# EAGLE design cmdc0de-apa104 (EAGLE 9.1.3)

## Sheet 1 of 2
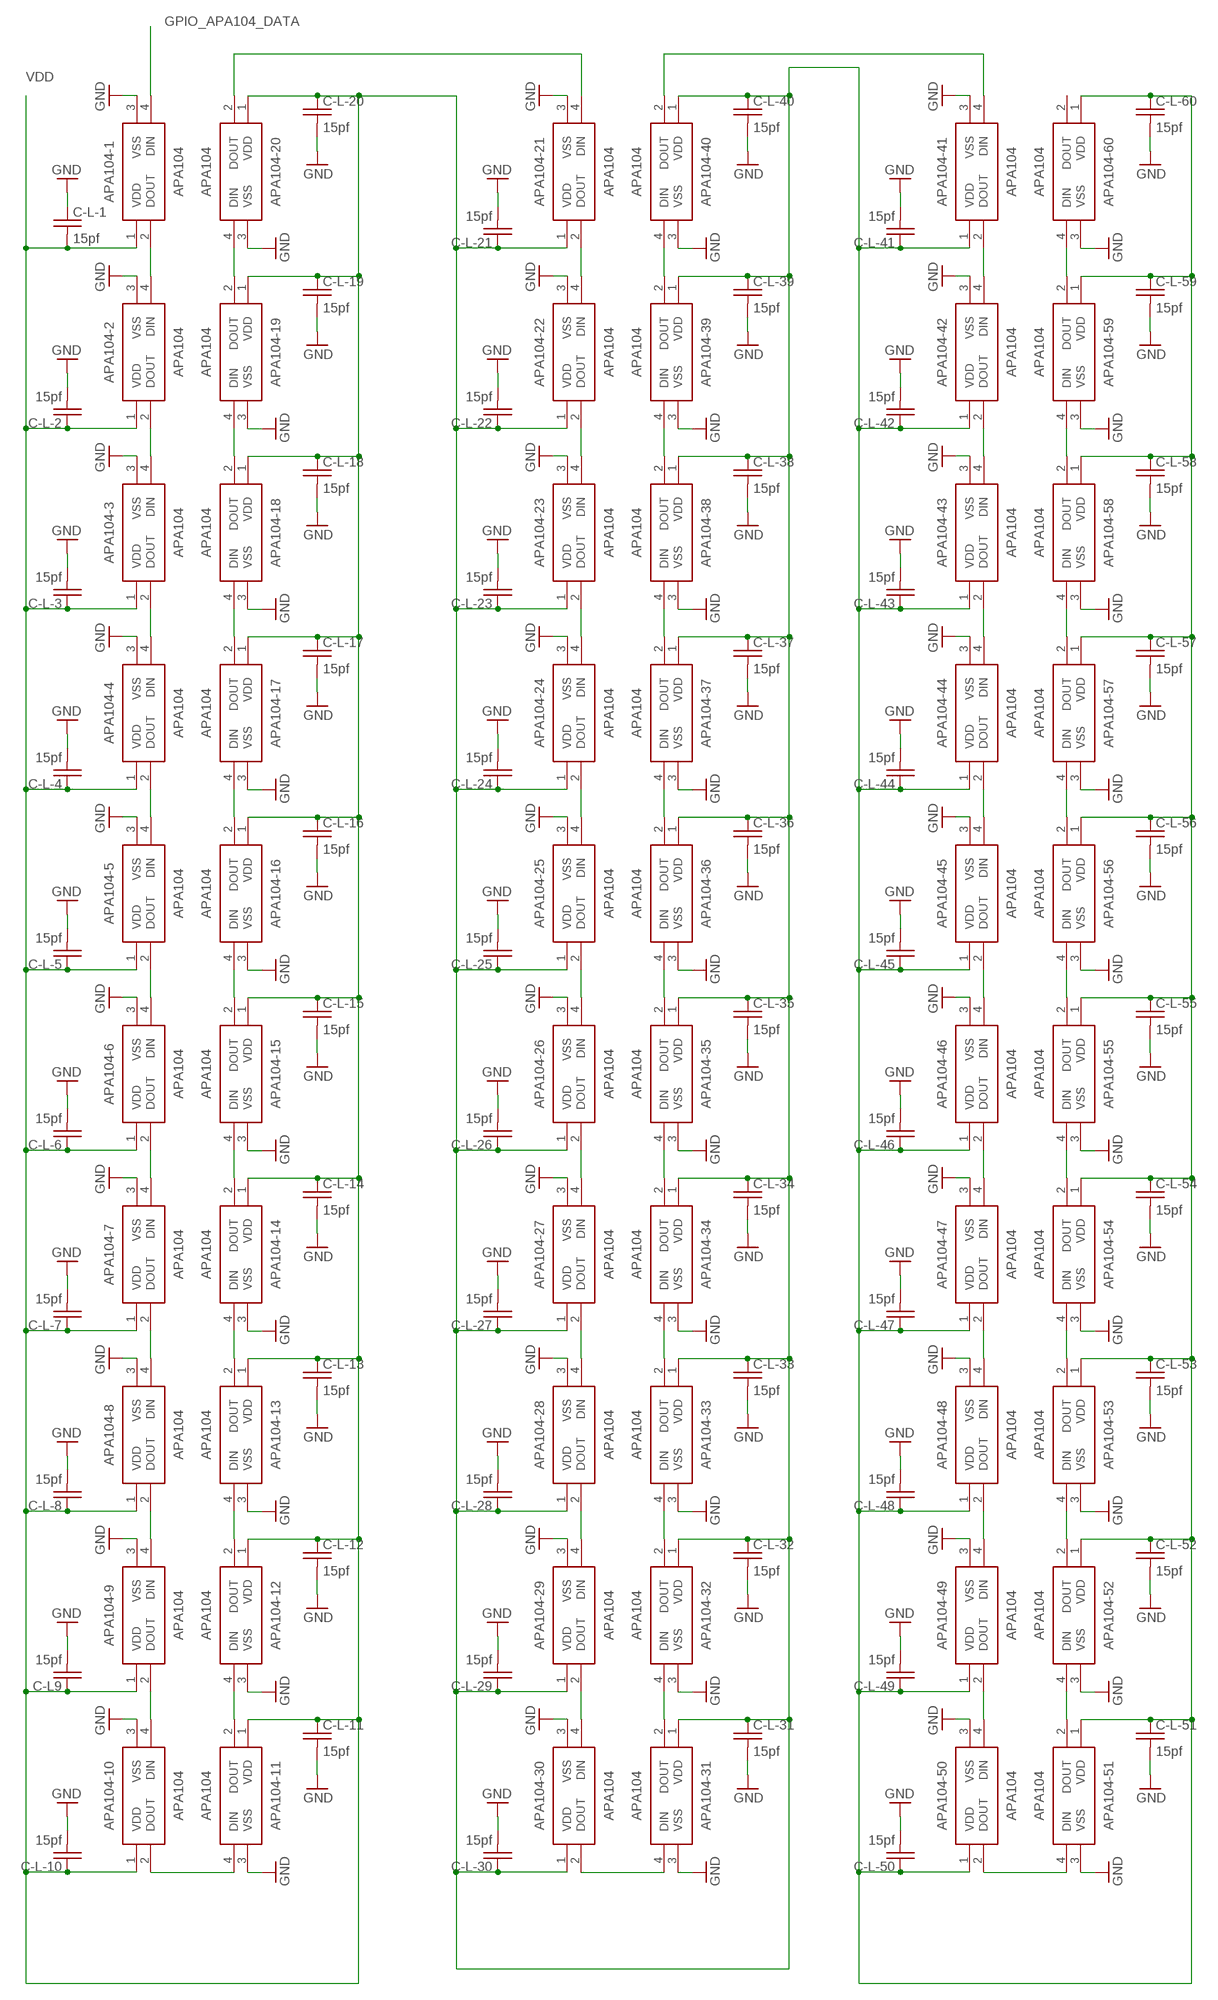
[diagram p0: schematic, sheet 1]

### Parts
APA104-1  APA104  [APA104]
APA104-2  APA104  [APA104]
APA104-3  APA104  [APA104]
APA104-4  APA104  [APA104]
APA104-5  APA104  [APA104]
APA104-6  APA104  [APA104]
APA104-7  APA104  [APA104]
APA104-8  APA104  [APA104]
APA104-9  APA104  [APA104]
APA104-10  APA104  [APA104]
APA104-11  APA104  [APA104]
APA104-12  APA104  [APA104]
APA104-13  APA104  [APA104]
APA104-14  APA104  [APA104]
APA104-15  APA104  [APA104]
APA104-16  APA104  [APA104]
APA104-17  APA104  [APA104]
APA104-18  APA104  [APA104]
APA104-19  APA104  [APA104]
APA104-20  APA104  [APA104]
APA104-21  APA104  [APA104]
APA104-22  APA104  [APA104]
APA104-23  APA104  [APA104]
APA104-24  APA104  [APA104]
APA104-25  APA104  [APA104]
APA104-26  APA104  [APA104]
APA104-27  APA104  [APA104]
APA104-28  APA104  [APA104]
APA104-29  APA104  [APA104]
APA104-30  APA104  [APA104]
APA104-31  APA104  [APA104]
APA104-32  APA104  [APA104]
APA104-33  APA104  [APA104]
APA104-34  APA104  [APA104]
APA104-35  APA104  [APA104]
APA104-36  APA104  [APA104]
APA104-37  APA104  [APA104]
APA104-38  APA104  [APA104]
APA104-39  APA104  [APA104]
APA104-40  APA104  [APA104]
APA104-41  APA104  [APA104]
APA104-42  APA104  [APA104]
APA104-43  APA104  [APA104]
APA104-44  APA104  [APA104]
APA104-45  APA104  [APA104]
APA104-46  APA104  [APA104]
APA104-47  APA104  [APA104]
APA104-48  APA104  [APA104]
APA104-49  APA104  [APA104]
APA104-50  APA104  [APA104]
APA104-51  APA104  [APA104]
APA104-52  APA104  [APA104]
APA104-53  APA104  [APA104]
APA104-54  APA104  [APA104]
APA104-55  APA104  [APA104]
APA104-56  APA104  [APA104]
APA104-57  APA104  [APA104]
APA104-58  APA104  [APA104]
APA104-59  APA104  [APA104]
APA104-60  APA104  [APA104]
C-L9  15pf  C-USC0805-VOLTERA  [C0805-VOLTA]
C-L-1  15pf  C-USC0805-VOLTERA  [C0805-VOLTA]
C-L-2  15pf  C-USC0805-VOLTERA  [C0805-VOLTA]
C-L-3  15pf  C-USC0805-VOLTERA  [C0805-VOLTA]
C-L-4  15pf  C-USC0805-VOLTERA  [C0805-VOLTA]
C-L-5  15pf  C-USC0805-VOLTERA  [C0805-VOLTA]
C-L-6  15pf  C-USC0805-VOLTERA  [C0805-VOLTA]
C-L-7  15pf  C-USC0805-VOLTERA  [C0805-VOLTA]
C-L-8  15pf  C-USC0805-VOLTERA  [C0805-VOLTA]
C-L-10  15pf  C-USC0805-VOLTERA  [C0805-VOLTA]
C-L-11  15pf  C-USC0805-VOLTERA  [C0805-VOLTA]
C-L-12  15pf  C-USC0805-VOLTERA  [C0805-VOLTA]
C-L-13  15pf  C-USC0805-VOLTERA  [C0805-VOLTA]
C-L-14  15pf  C-USC0805-VOLTERA  [C0805-VOLTA]
C-L-15  15pf  C-USC0805-VOLTERA  [C0805-VOLTA]
C-L-16  15pf  C-USC0805-VOLTERA  [C0805-VOLTA]
C-L-17  15pf  C-USC0805-VOLTERA  [C0805-VOLTA]
C-L-18  15pf  C-USC0805-VOLTERA  [C0805-VOLTA]
C-L-19  15pf  C-USC0805-VOLTERA  [C0805-VOLTA]
C-L-20  15pf  C-USC0805-VOLTERA  [C0805-VOLTA]
C-L-21  15pf  C-USC0805-VOLTERA  [C0805-VOLTA]
C-L-22  15pf  C-USC0805-VOLTERA  [C0805-VOLTA]
C-L-23  15pf  C-USC0805-VOLTERA  [C0805-VOLTA]
C-L-24  15pf  C-USC0805-VOLTERA  [C0805-VOLTA]
C-L-25  15pf  C-USC0805-VOLTERA  [C0805-VOLTA]
C-L-26  15pf  C-USC0805-VOLTERA  [C0805-VOLTA]
C-L-27  15pf  C-USC0805-VOLTERA  [C0805-VOLTA]
C-L-28  15pf  C-USC0805-VOLTERA  [C0805-VOLTA]
C-L-29  15pf  C-USC0805-VOLTERA  [C0805-VOLTA]
C-L-30  15pf  C-USC0805-VOLTERA  [C0805-VOLTA]
C-L-31  15pf  C-USC0805-VOLTERA  [C0805-VOLTA]
C-L-32  15pf  C-USC0805-VOLTERA  [C0805-VOLTA]
C-L-33  15pf  C-USC0805-VOLTERA  [C0805-VOLTA]
C-L-34  15pf  C-USC0805-VOLTERA  [C0805-VOLTA]
C-L-35  15pf  C-USC0805-VOLTERA  [C0805-VOLTA]
C-L-36  15pf  C-USC0805-VOLTERA  [C0805-VOLTA]
C-L-37  15pf  C-USC0805-VOLTERA  [C0805-VOLTA]
C-L-38  15pf  C-USC0805-VOLTERA  [C0805-VOLTA]
C-L-39  15pf  C-USC0805-VOLTERA  [C0805-VOLTA]
C-L-40  15pf  C-USC0805-VOLTERA  [C0805-VOLTA]
C-L-41  15pf  C-USC0805-VOLTERA  [C0805-VOLTA]
C-L-42  15pf  C-USC0805-VOLTERA  [C0805-VOLTA]
C-L-43  15pf  C-USC0805-VOLTERA  [C0805-VOLTA]
C-L-44  15pf  C-USC0805-VOLTERA  [C0805-VOLTA]
C-L-45  15pf  C-USC0805-VOLTERA  [C0805-VOLTA]
C-L-46  15pf  C-USC0805-VOLTERA  [C0805-VOLTA]
C-L-47  15pf  C-USC0805-VOLTERA  [C0805-VOLTA]
C-L-48  15pf  C-USC0805-VOLTERA  [C0805-VOLTA]
C-L-49  15pf  C-USC0805-VOLTERA  [C0805-VOLTA]
C-L-50  15pf  C-USC0805-VOLTERA  [C0805-VOLTA]
C-L-51  15pf  C-USC0805-VOLTERA  [C0805-VOLTA]
C-L-52  15pf  C-USC0805-VOLTERA  [C0805-VOLTA]
C-L-53  15pf  C-USC0805-VOLTERA  [C0805-VOLTA]
C-L-54  15pf  C-USC0805-VOLTERA  [C0805-VOLTA]
C-L-55  15pf  C-USC0805-VOLTERA  [C0805-VOLTA]
C-L-56  15pf  C-USC0805-VOLTERA  [C0805-VOLTA]
C-L-57  15pf  C-USC0805-VOLTERA  [C0805-VOLTA]
C-L-58  15pf  C-USC0805-VOLTERA  [C0805-VOLTA]
C-L-59  15pf  C-USC0805-VOLTERA  [C0805-VOLTA]
C-L-60  15pf  C-USC0805-VOLTERA  [C0805-VOLTA]

### Nets
GND: APA104-1.3(VSS) APA104-2.3(VSS) APA104-3.3(VSS) APA104-4.3(VSS) APA104-5.3(VSS) APA104-6.3(VSS) APA104-7.3(VSS) APA104-8.3(VSS) APA104-9.3(VSS) APA104-10.3(VSS) APA104-11.3(VSS) APA104-12.3(VSS) APA104-13.3(VSS) APA104-14.3(VSS) APA104-15.3(VSS) APA104-16.3(VSS) APA104-17.3(VSS) APA104-18.3(VSS) APA104-19.3(VSS) APA104-20.3(VSS) APA104-21.3(VSS) APA104-22.3(VSS) APA104-23.3(VSS) APA104-24.3(VSS) APA104-25.3(VSS) APA104-26.3(VSS) APA104-27.3(VSS) APA104-28.3(VSS) APA104-29.3(VSS) APA104-30.3(VSS) APA104-31.3(VSS) APA104-32.3(VSS) APA104-33.3(VSS) APA104-34.3(VSS) APA104-35.3(VSS) APA104-36.3(VSS) APA104-37.3(VSS) APA104-38.3(VSS) APA104-39.3(VSS) APA104-40.3(VSS) APA104-41.3(VSS) APA104-42.3(VSS) APA104-43.3(VSS) APA104-44.3(VSS) APA104-45.3(VSS) APA104-46.3(VSS) APA104-47.3(VSS) APA104-48.3(VSS) APA104-49.3(VSS) APA104-50.3(VSS) APA104-51.3(VSS) APA104-52.3(VSS) APA104-53.3(VSS) APA104-54.3(VSS) APA104-55.3(VSS) APA104-56.3(VSS) APA104-57.3(VSS) APA104-58.3(VSS) APA104-59.3(VSS) APA104-60.3(VSS) C-L9.2 C-L-1.1 C-L-2.2 C-L-3.2 C-L-4.2 C-L-5.2 C-L-6.2 C-L-7.2 C-L-8.2 C-L-10.2 C-L-11.2 C-L-12.2 C-L-13.2 C-L-14.2 C-L-15.2 C-L-16.2 C-L-17.2 C-L-18.2 C-L-19.2 C-L-20.2 C-L-21.2 C-L-22.2 C-L-23.2 C-L-24.2 C-L-25.2 C-L-26.2 C-L-27.2 C-L-28.2 C-L-29.2 C-L-30.2 C-L-31.2 C-L-32.2 C-L-33.2 C-L-34.2 C-L-35.2 C-L-36.2 C-L-37.2 C-L-38.2 C-L-39.2 C-L-40.2 C-L-41.2 C-L-42.2 C-L-43.2 C-L-44.2 C-L-45.2 C-L-46.2 C-L-47.2 C-L-48.2 C-L-49.2 C-L-50.2 C-L-51.2 C-L-52.2 C-L-53.2 C-L-54.2 C-L-55.2 C-L-56.2 C-L-57.2 C-L-58.2 C-L-59.2 C-L-60.2 ; also sheet 2
GPIO_APA104_DATA: APA104-1.4(DIN) ; also sheet 2
GPIO_APA104_DATA1: APA104-40.2(DOUT) APA104-41.4(DIN)
N$1: APA104-2.2(DOUT) APA104-3.4(DIN)
N$2: APA104-3.2(DOUT) APA104-4.4(DIN)
N$3: APA104-4.2(DOUT) APA104-5.4(DIN)
N$4: APA104-5.2(DOUT) APA104-6.4(DIN)
N$5: APA104-6.2(DOUT) APA104-7.4(DIN)
N$6: APA104-7.2(DOUT) APA104-8.4(DIN)
N$7: APA104-8.2(DOUT) APA104-9.4(DIN)
N$8: APA104-9.2(DOUT) APA104-10.4(DIN)
N$9: APA104-10.2(DOUT) APA104-11.4(DIN)
N$10: APA104-11.2(DOUT) APA104-12.4(DIN)
N$11: APA104-12.2(DOUT) APA104-13.4(DIN)
N$12: APA104-13.2(DOUT) APA104-14.4(DIN)
N$13: APA104-14.2(DOUT) APA104-15.4(DIN)
N$14: APA104-15.2(DOUT) APA104-16.4(DIN)
N$15: APA104-16.2(DOUT) APA104-17.4(DIN)
N$16: APA104-17.2(DOUT) APA104-18.4(DIN)
N$17: APA104-18.2(DOUT) APA104-19.4(DIN)
N$18: APA104-19.2(DOUT) APA104-20.4(DIN)
N$19: APA104-21.2(DOUT) APA104-22.4(DIN)
N$20: APA104-22.2(DOUT) APA104-23.4(DIN)
N$21: APA104-23.2(DOUT) APA104-24.4(DIN)
N$22: APA104-24.2(DOUT) APA104-25.4(DIN)
N$23: APA104-25.2(DOUT) APA104-26.4(DIN)
N$24: APA104-26.2(DOUT) APA104-27.4(DIN)
N$25: APA104-27.2(DOUT) APA104-28.4(DIN)
N$26: APA104-28.2(DOUT) APA104-29.4(DIN)
N$27: APA104-29.2(DOUT) APA104-30.4(DIN)
N$28: APA104-30.2(DOUT) APA104-31.4(DIN)
N$29: APA104-20.2(DOUT) APA104-21.4(DIN)
N$30: APA104-41.2(DOUT) APA104-42.4(DIN)
N$31: APA104-1.2(DOUT) APA104-2.4(DIN)
N$32: APA104-31.2(DOUT) APA104-32.4(DIN)
N$33: APA104-32.2(DOUT) APA104-33.4(DIN)
N$34: APA104-33.2(DOUT) APA104-34.4(DIN)
N$35: APA104-34.2(DOUT) APA104-35.4(DIN)
N$36: APA104-35.2(DOUT) APA104-36.4(DIN)
N$37: APA104-36.2(DOUT) APA104-37.4(DIN)
N$38: APA104-37.2(DOUT) APA104-38.4(DIN)
N$39: APA104-38.2(DOUT) APA104-39.4(DIN)
N$40: APA104-39.2(DOUT) APA104-40.4(DIN)
N$41: APA104-50.2(DOUT) APA104-51.4(DIN)
N$42: APA104-42.2(DOUT) APA104-43.4(DIN)
N$43: APA104-43.2(DOUT) APA104-44.4(DIN)
N$44: APA104-44.2(DOUT) APA104-45.4(DIN)
N$45: APA104-45.2(DOUT) APA104-46.4(DIN)
N$46: APA104-46.2(DOUT) APA104-47.4(DIN)
N$47: APA104-47.2(DOUT) APA104-48.4(DIN)
N$48: APA104-48.2(DOUT) APA104-49.4(DIN)
N$49: APA104-49.2(DOUT) APA104-50.4(DIN)
N$51: APA104-51.2(DOUT) APA104-52.4(DIN)
N$52: APA104-52.2(DOUT) APA104-53.4(DIN)
N$53: APA104-53.2(DOUT) APA104-54.4(DIN)
N$54: APA104-54.2(DOUT) APA104-55.4(DIN)
N$55: APA104-55.2(DOUT) APA104-56.4(DIN)
N$56: APA104-56.2(DOUT) APA104-57.4(DIN)
N$57: APA104-57.2(DOUT) APA104-58.4(DIN)
N$58: APA104-58.2(DOUT) APA104-59.4(DIN)
N$59: APA104-59.2(DOUT) APA104-60.4(DIN)
VDD: APA104-1.1(VDD) APA104-2.1(VDD) APA104-3.1(VDD) APA104-4.1(VDD) APA104-5.1(VDD) APA104-6.1(VDD) APA104-7.1(VDD) APA104-8.1(VDD) APA104-9.1(VDD) APA104-10.1(VDD) APA104-11.1(VDD) APA104-12.1(VDD) APA104-13.1(VDD) APA104-14.1(VDD) APA104-15.1(VDD) APA104-16.1(VDD) APA104-17.1(VDD) APA104-18.1(VDD) APA104-19.1(VDD) APA104-20.1(VDD) APA104-21.1(VDD) APA104-22.1(VDD) APA104-23.1(VDD) APA104-24.1(VDD) APA104-25.1(VDD) APA104-26.1(VDD) APA104-27.1(VDD) APA104-28.1(VDD) APA104-29.1(VDD) APA104-30.1(VDD) APA104-31.1(VDD) APA104-32.1(VDD) APA104-33.1(VDD) APA104-34.1(VDD) APA104-35.1(VDD) APA104-36.1(VDD) APA104-37.1(VDD) APA104-38.1(VDD) APA104-39.1(VDD) APA104-40.1(VDD) APA104-41.1(VDD) APA104-42.1(VDD) APA104-43.1(VDD) APA104-44.1(VDD) APA104-45.1(VDD) APA104-46.1(VDD) APA104-47.1(VDD) APA104-48.1(VDD) APA104-49.1(VDD) APA104-50.1(VDD) APA104-51.1(VDD) APA104-52.1(VDD) APA104-53.1(VDD) APA104-54.1(VDD) APA104-55.1(VDD) APA104-56.1(VDD) APA104-57.1(VDD) APA104-58.1(VDD) APA104-59.1(VDD) APA104-60.1(VDD) C-L9.1 C-L-1.2 C-L-2.1 C-L-3.1 C-L-4.1 C-L-5.1 C-L-6.1 C-L-7.1 C-L-8.1 C-L-10.1 C-L-11.1 C-L-12.1 C-L-13.1 C-L-14.1 C-L-15.1 C-L-16.1 C-L-17.1 C-L-18.1 C-L-19.1 C-L-20.1 C-L-21.1 C-L-22.1 C-L-23.1 C-L-24.1 C-L-25.1 C-L-26.1 C-L-27.1 C-L-28.1 C-L-29.1 C-L-30.1 C-L-31.1 C-L-32.1 C-L-33.1 C-L-34.1 C-L-35.1 C-L-36.1 C-L-37.1 C-L-38.1 C-L-39.1 C-L-40.1 C-L-41.1 C-L-42.1 C-L-43.1 C-L-44.1 C-L-45.1 C-L-46.1 C-L-47.1 C-L-48.1 C-L-49.1 C-L-50.1 C-L-51.1 C-L-52.1 C-L-53.1 C-L-54.1 C-L-55.1 C-L-56.1 C-L-57.1 C-L-58.1 C-L-59.1 C-L-60.1 ; also sheet 2
Unconnected: APA104-60.2(DOUT)

## Sheet 2 of 2
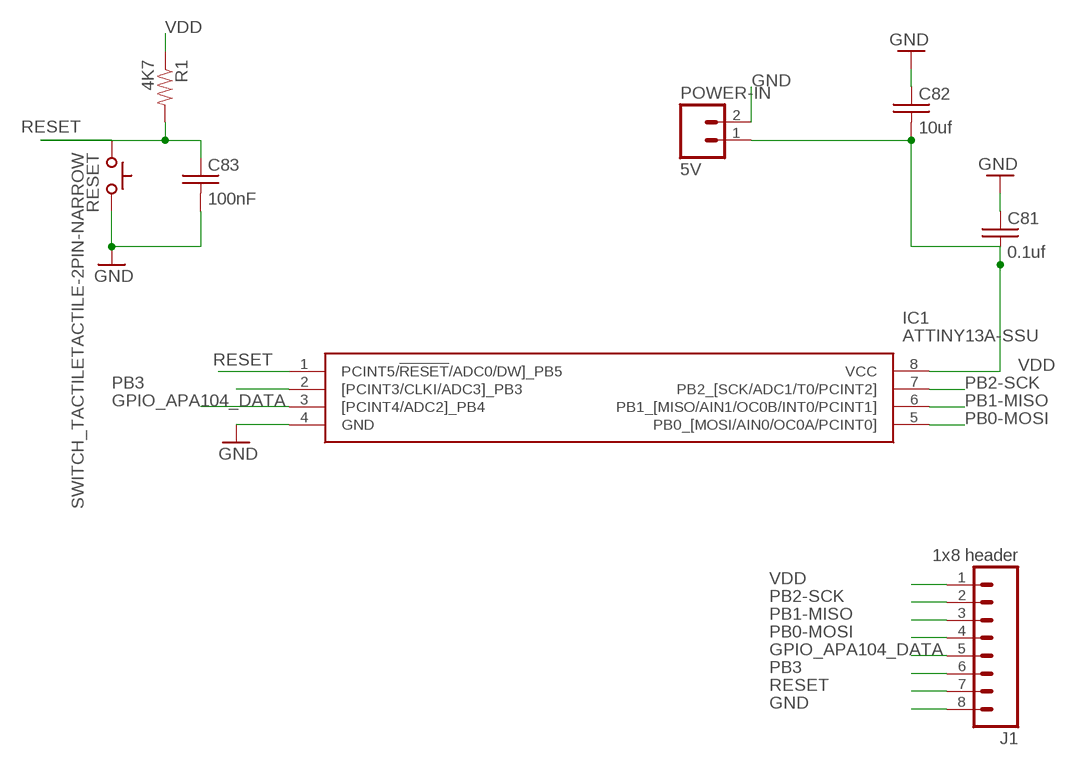
[diagram p1: schematic, sheet 2]

### Parts
C81  0.1uf  C-USC0805-VOLTERA  [C0805-VOLTA]
C82  10uf  C-USC0805-VOLTERA  [C0805-VOLTA]
C83  100nF  C-USC0805-VOLTERA  [C0805-VOLTA]
IC1  ATTINY13A-SSU  [SOIC127P600X175-8N]
J1  1x8 header  M08SILK_FEMALE_PTH  [1X08]
POWER-IN  5V  M02PTH  [1X02]
R1  4K7  RESISTOR0805-RES  [0805]
RESET  SWITCH_TACTILETACTILE-2PIN-NARROW  [TACTILE-2PIN-NARROW]

### Nets
GND: C81.1 C82.1 C83.2 IC1.4(GND) J1.8 POWER-IN.2 RESET.P$1(A) ; also sheet 1
GPIO_APA104_DATA: IC1.3([PCINT4/ADC2]_PB4) J1.5 ; also sheet 1
PB0-MOSI: IC1.5(PB0_[MOSI/AIN0/OC0A/PCINT0]) J1.4
PB1-MISO: IC1.6(PB1_[MISO/AIN1/OC0B/INT0/PCINT1]) J1.3
PB2-SCK: IC1.7(PB2_[SCK/ADC1/T0/PCINT2]) J1.2
PB3: IC1.2([PCINT3/CLKI/ADC3]_PB3) J1.6
RESET: C83.1 IC1.1(PCINT5/!RESET!/ADC0/DW]_PB5) J1.7 R1.2 RESET.P$2(C)
VDD: C81.2 C82.2 IC1.8(VCC) J1.1 POWER-IN.1 R1.1 ; also sheet 1

## Library data of the parts
APA104-1-APA104-60 = name-in-lights:APA104: APA104 LED CHIP Source: Datasheet <http://www.ledlightinghut.com/files/APA104%20Datasheet.pdf>; DESCRIPTION: APA104 LED Chip; HEIGHT: mm; MANUFACTURER_NAME: Worldsemi; MANUFACTURER_PART_NUMBER: APA104; SUPPLIER_NAME: RS
C81-C83 C-L9 C-L-1-C-L-8 C-L-10-C-L-60 = name-in-lights:C-US: CAPACITOR, American symbol
IC1 = NameInLights:ATTINY13A-SSU: ATTINY13A-SSU, 8 bit AVR Microcontroller 20MHz 1, 64kB, B Flash, 64B RAM, SPI 8-Pin SOIC Source: Datasheet <http://www.atmel.com/images/doc8126.pdf>; ARROW_PART_NUMBER: ATTINY13A-SSU; ARROW_PRICE/STOCK: https://www.arrow.com/en/products/attiny13a-ssu/microchip-technology; DESCRIPTION: ATTINY13A-SSU, 8 bit AVR Microcontroller 20MHz 1, 64kB, B Flash, 64B RAM, SPI 8-Pin SOIC; HEIGHT: 1.75mm; MANUFACTURER_NAME: Microchip; MANUFACTURER_PART_NUMBER: ATTINY13A-SSU; RS_PART_NUMBER: 9214573; RS_PRICE/STOCK: http://uk.rs-online.com/web/p/products/9214573
J1 = NameInLights:M08: Header 8 Standard 8-pin 0.1" header. Use with straight break away headers (SKU : PRT-00116), right angle break away headers (PRT-00553), swiss pins (PRT-00743), machine pins (PRT-00117), and female headers (PRT-00115).; PROD_ID: CONN-08438
POWER-IN = name-in-lights:M02: Standard 2-pin 0.1" header. Use with - straight break away headers ( PRT-00116) - right angle break away headers (PRT-00553) - swiss pins (PRT-00743) - machine pins (PRT-00117) - female headers (PRT-00115) Molex polarized connector foot print use with: PRT-08233 with associated crimp pins and housings. 2.54_SCREWTERM for use with PRT-10571. 3.5mm Screw Terminal footprints for PRT-08084 5mm Screw Terminal footprints for use with PRT-08432
R1 = NameInLights:RESISTOR: Resistor Basic schematic elements and footprints for 0603, 1206, and PTH resistors.
RESET = NameInLights:SWITCH_TACTILE

## Board
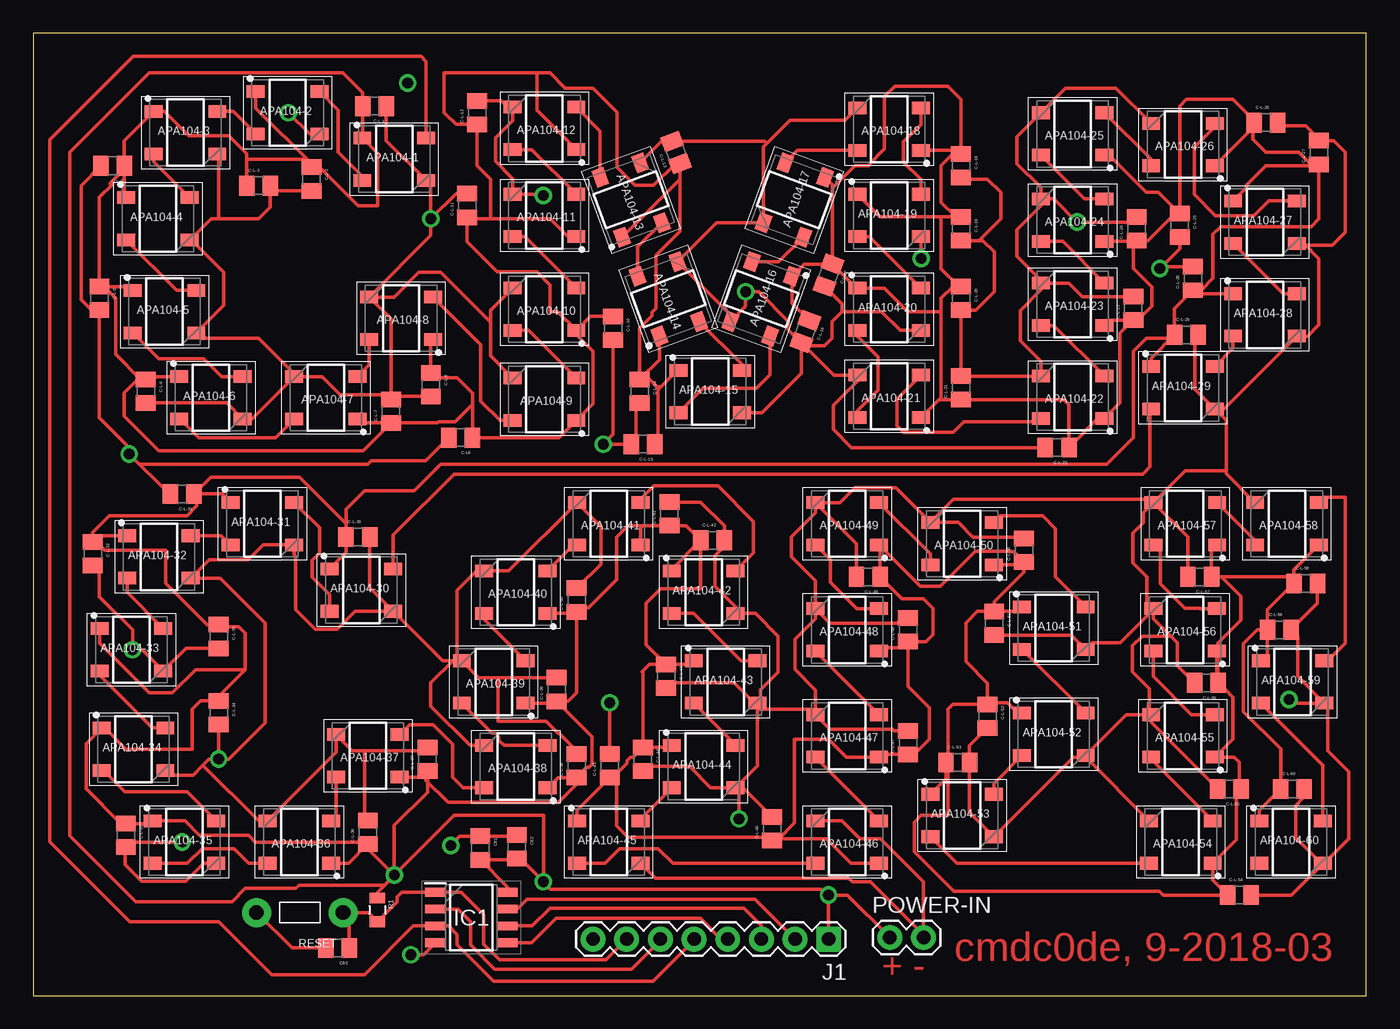
[diagram p2: board, top side]
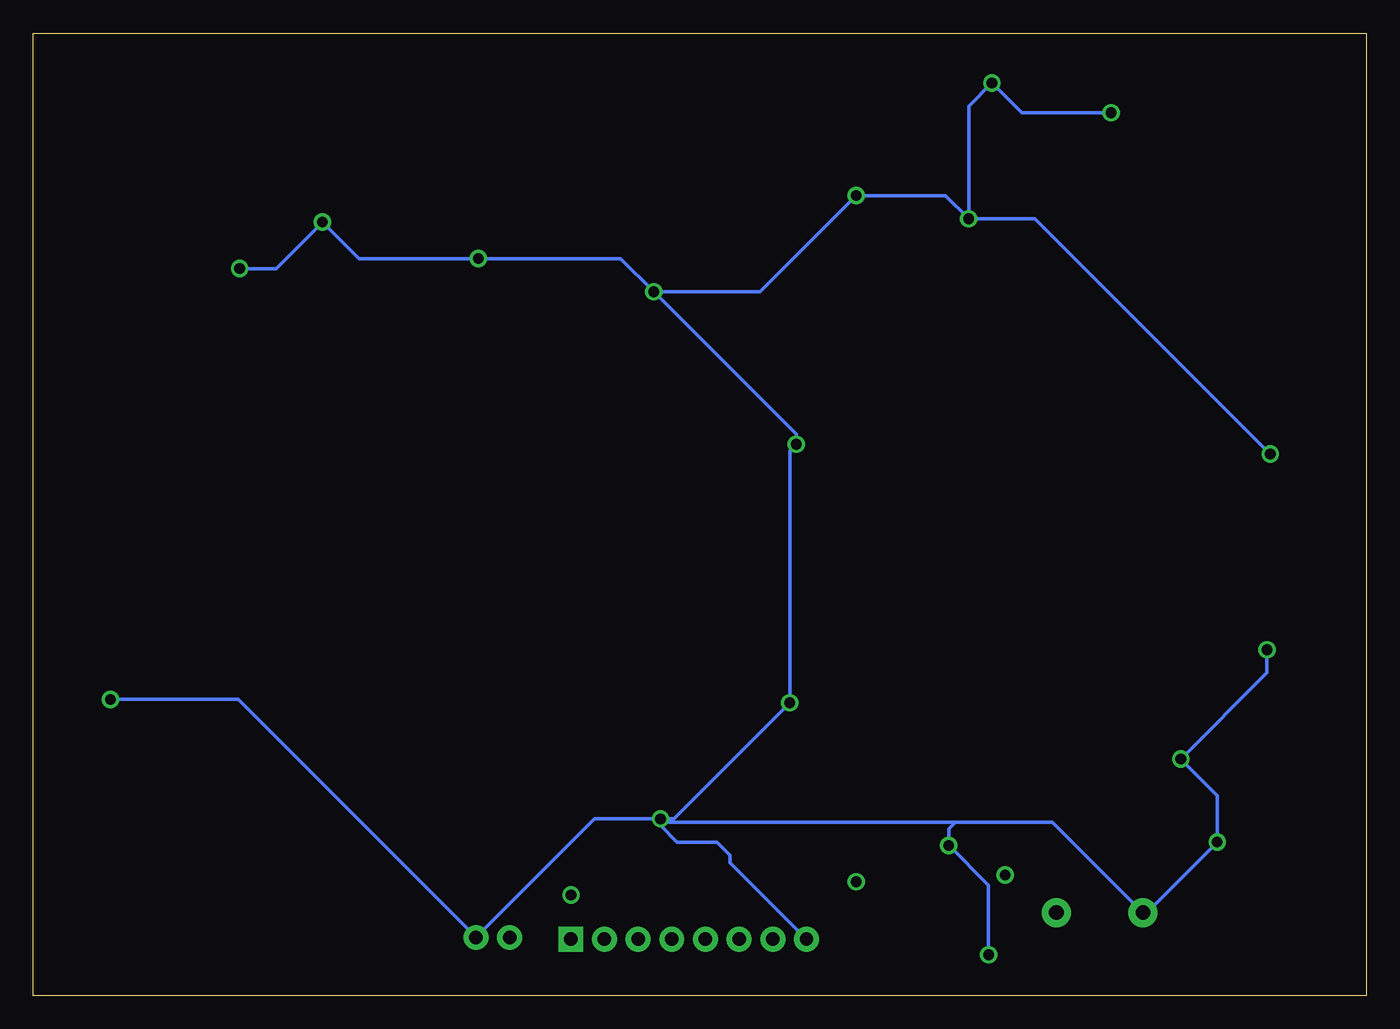
[diagram p3: board, bottom side, seen from below]

Size 100.58 x 72.6 mm. Coordinates in mm from the lower left corner, seen from the top.
Outline: 0,0 100.58,0 100.58,72.6 0,72.6 0,0
Copper layers (1*16): Top 0.035mm / dielectric 1.5mm / Bottom 0.035mm
Design rules "OthermillDRC_1_100_v2": minimum track width 8mil, minimum drill 0.8mm, track to track 0.256540625mm, track to pad 0.256540625mm, pad to pad 0.256540625mm, via to via 0.256540625mm, smd to smd 0mil, copper to edge 0mil, drill to drill 1mil, minimum pad ring 10mil, minimum via ring 10mil, stop-mask expansion 1mil, vias tented up to drill 30mil, thermal gap 10mil

### Footprints (pad centres in the part's own frame; a part is rotated, then mirrored left to right if it is on the bottom)
APA104 = smd 1.35 x 0.95: 1 -2.4,1.6; 2 -2.4,-1.6; 3 2.4,-1.6; 4 2.4,1.6
C0805-VOLTA = smd 1.168 x 1.499: 1 -0.889,0; 2 0.889,0
SOIC127P600X175-8N = smd 1.525 x 0.65: 1 -2.712,1.905; 2 -2.712,0.635; 3 -2.712,-0.635; 4 -2.712,-1.905; 5 2.712,-1.905; 6 2.712,-0.635; 7 2.712,0.635; 8 2.712,1.905
1X08 = drill 1.016 pad 1.88 square: 1 0,0 | drill 1.016 pad 1.88: 2 2.54,0; 3 5.08,0; 4 7.62,0; 5 10.16,0; 6 12.7,0; 7 15.24,0; 8 17.78,0
1X02 = drill 1.016 pad 1.88: 1 0,0; 2 2.54,0
0805 = smd 0.8 x 1.2: 1 -0.9,0; 2 0.9,0
TACTILE-2PIN-NARROW = drill 1.1 pad 2.184: P$1 3.264,0; P$2 -3.264,0

### Placement (x,y rotation side)
APA104-1  27.24,63.1 0 top
APA104-2  19.2,66.6 0 top
APA104-3  11.5,65.1 0 top
APA104-4  9.42,58.6 0 top
APA104-5  9.92,51.6 0 top
APA104-6  13.42,45.1 0 top
APA104-7  22.08,45.1 180 top
APA104-8  27.76,51.1 180 top
APA104-9  38.58,44.99 180 top
APA104-10  38.58,51.78 180 top
APA104-11  38.58,58.85 180 top
APA104-12  38.58,65.42 180 top
APA104-13  45.11,60.02 110 top
APA104-14  47.92,52.56 110 top
APA104-15  51.08,45.57 0 top
APA104-16  54.92,52.56 250 top
APA104-17  57.42,60.02 250 top
APA104-18  64.58,65.36 180 top
APA104-19  64.58,58.85 0 top
APA104-20  64.58,51.78 0 top
APA104-21  64.58,45.21 180 top
APA104-22  78.42,45.15 180 top
APA104-23  78.42,52.15 180 top
APA104-24  78.42,58.5 180 top
APA104-25  78.42,65 180 top
APA104-26  86.74,64.2 180 top
APA104-27  92.92,58.35 0 top
APA104-28  92.92,51.35 0 top
APA104-29  86.74,45.85 0 top
APA104-30  24.76,30.6 0 top
APA104-31  17.3,35.6 0 top
APA104-32  9.5,33.1 0 top
APA104-33  7.42,26.1 0 top
APA104-34  7.58,18.6 0 top
APA104-35  11.42,11.6 0 top
APA104-36  20.08,11.6 180 top
APA104-37  25.26,18.1 180 top
APA104-38  36.42,17.29 180 top
APA104-39  34.74,23.67 180 top
APA104-40  36.42,30.44 180 top
APA104-41  43.42,35.6 180 top
APA104-42  50.58,30.44 0 top
APA104-43  52.24,23.67 0 top
APA104-44  50.58,17.29 0 top
APA104-45  43.42,11.6 0 top
APA104-46  61.42,11.6 180 top
APA104-47  61.42,19.6 180 top
APA104-48  61.42,27.6 180 top
APA104-49  61.42,35.6 180 top
APA104-50  70.08,34.1 180 top
APA104-51  77,27.73 0 top
APA104-52  77,19.73 0 top
APA104-53  70.08,13.6 0 top
APA104-54  86.58,11.6 180 top
APA104-55  86.74,19.6 180 top
APA104-56  86.9,27.6 180 top
APA104-57  86.92,35.6 180 top
APA104-58  94.58,35.6 180 top
APA104-59  95.01,23.67 0 top
APA104-60  94.9,11.6 0 top
C81  33.74,11.15 270 top
C82  36.49,11.23 270 top
C83  22.96,3.61 180 top
C-L9  32.25,42.1 180 top
C-L-1  25.75,67.1 180 top
C-L-2  21,61.6 270 top
C-L-3  17,61.1 0 top
C-L-4  6,62.6 180 top
C-L-5  5,52.6 270 top
C-L-6  8.5,45.6 270 top
C-L-7  27,44.1 90 top
C-L-8  30,46.1 270 top
C-L-10  43.75,50.35 270 top
C-L-11  32.75,59.6 90 top
C-L-12  33.5,66.6 90 top
C-L-13  48.5,63.6 110 top
C-L-14  45.75,45.6 270 top
C-L-15  46,41.6 180 top
C-L-16  58.25,50.1 250 top
C-L-17  60,54.35 250 top
C-L-18  70,62.6 270 top
C-L-19  70,57.85 270 top
C-L-20  70,52.6 270 top
C-L-21  70,45.85 90 top
C-L-22  77.25,41.35 180 top
C-L-23  83,51.85 90 top
C-L-24  83.25,57.85 90 top
C-L-25  86.5,58.1 270 top
C-L-26  93,65.85 0 top
C-L-27  97,63.6 90 top
C-L-28  87.5,54.1 90 top
C-L-29  87,49.85 0 top
C-L-30  24.5,34.6 0 top
C-L-31  11.25,37.85 180 top
C-L-32  4.5,33.35 270 top
C-L-33  14,27.1 270 top
C-L-34  14,21.35 270 top
C-L-35  7,12.1 270 top
C-L-36  25.25,12.35 90 top
C-L-37  29.75,17.85 90 top
C-L-38  41,17.35 90 top
C-L-39  39.5,23.1 90 top
C-L-40  41,29.85 90 top
C-L-41  48,36.35 90 top
C-L-42  51.25,34.35 0 top
C-L-43  47.75,24.1 270 top
C-L-44  46,17.85 270 top
C-L-45  43.5,17.35 90 top
C-L-46  55.75,12.6 90 top
C-L-47  66,19.1 90 top
C-L-48  66,27.6 90 top
C-L-49  63,31.6 180 top
C-L-50  74.75,33.6 90 top
C-L-51  72.5,28.1 270 top
C-L-52  72,21.1 270 top
C-L-53  69.75,17.6 0 top
C-L-54  91,7.6 0 top
C-L-55  90.25,15.6 180 top
C-L-56  88.5,23.6 180 top
C-L-57  88,31.6 180 top
C-L-58  96,31.1 0 top
C-L-59  94,27.6 0 top
C-L-60  95,15.6 0 top
IC1  33.06,5.91 0 top
J1  60.02,4.28 180 top
POWER-IN  64.63,4.4 0 top
R1  25.97,6.49 270 top
RESET  20.12,6.28 180 top

### Tracks (layer width: path | path; a pad name or v marks a point on that pad's centre or on a via)
GND  (via drill 0.8)
  Top 0.254: C-L-1.1 26.64,64.5 APA104-1.3 30,61.14 v30,58.6 | C-L-6.2 14.61,44.71 APA104-6.3 16.48,43.5 APA104-7.3 | C-L-5.2 5,51.12 | C-L-7.2 27,51.06 APA104-8.3 | C-L-8.2 27.22,45.21 C-L-7.2 | APA104-9.3 34.51,48.26 34.51,50.79 | APA104-8.3 27.22,52.7 29.08,54.56 30.74,54.56 34.51,50.79 | 34.51,50.79 34.51,51.71 APA104-10.3 | 36.18,66.6 36.18,66.01 34.87,64.7 34.87,62.94 36.18,61.63 APA104-11.3 38.4,60.45 v38.5,60.35 | 36.18,66.6 APA104-12.3 | C-L-12.2 35.29,67.49 36.18,66.6 | APA104-18.3 61.24,66.02 57.09,66.02 55.34,64.27 | 55.34,64.27 55.1,64.03 APA104-17.3 51.55,58.31 APA104-14.3 52.6,51.37 APA104-16.3 53.75,52.01 v53.75,53.1 54.75,53.1 57,50.85 57,50.21 C-L-16.2 | C-L-16.2 57.95,46.94 54.98,43.97 APA104-15.3 | C-L-16.2 58.18,49.03 | 58.18,49.03 60.4,46.81 APA104-21.3 62.18,46.34 60.37,44.53 60.37,42.73 61.75,41.35 C-L-22.2 | APA104-23.3 76.02,53.24 74.46,51.68 74.46,49.42 76.02,47.86 APA104-22.3 76.01,46.74 C-L-21.2 C-L-20.2 71.11,51.71 72.5,53.1 72.5,56.1 71.64,56.96 C-L-19.2 71.36,56.96 73,58.6 73,60.6 72,61.6 70.11,61.6 C-L-18.2 | APA104-23.3 78.13,53.75 79.14,52.74 C-L-23.2 | APA104-23.3 76.02,53.96 74.21,55.77 74.21,57.78 76.02,59.59 APA104-24.3 | APA104-24.3 76.02,60.96 74.21,62.77 74.21,64.78 APA104-25.3 77.88,68.46 81.68,68.46 APA104-26.3 | APA104-29.3 89.82,44.25 APA104-28.3 96.15,49.75 97,50.6 97,55.6 95.85,56.75 APA104-27.3 95.47,56.6 98,56.6 99,57.6 99,63.6 98.11,64.49 C-L-27.2 97,64.6 96,65.6 94.14,65.6 C-L-26.2 | APA104-29.3 87.64,45.75 87.64,49.6 C-L-29.2 | APA104-29.3 90,43.39 90,39.6 | APA104-58.3 90,39.38 90,39.6 | 90,39.6 86.92,39.6 APA104-57.3
  Top 0.254: C-L-58.2 96.89,29.6 C-L-59.2 95.39,27.1 95.39,24.09 APA104-59.3 | APA104-60.3 97.2,9.9 | 97.2,9.9 94.9,7.6 C-L-54.2 | APA104-54.3 79.4,17.98 | 79.4,17.98 APA104-52.3 82.47,21.2 APA104-55.3 | 85.83,27.11 83.67,27.11 82.94,26.38 82.94,24.43 84.21,23.16 84.21,21.33 APA104-55.3 | 85.83,27.11 86.31,26.63 86.31,24.91 C-L-56.2 | 84.5,29.1 APA104-56.3 84.02,29.68 84.02,31.6 82.96,32.66 82.96,34.88 83.77,35.69 83.77,36.45 APA104-57.3 | 85.83,27.11 84.5,28.44 84.5,29.1 | 84.5,29.1 82.03,26.63 79.9,26.63 APA104-51.3 78.32,27.21 C-L-51.2 | C-L-57.2 87.11,34.61 APA104-57.3 | APA104-50.3 69.43,37.45 84.27,37.45 APA104-57.3 | APA104-50.3 69.79,35.7 70.9,34.59 74.64,34.59 C-L-50.2 | APA104-49.3 60.88,37.2 61.99,38.31 65.07,38.31 APA104-50.3 | APA104-49.3 62.11,34.11 C-L-49.2 | APA104-49.3 59.02,36.44 57.21,34.63 57.21,33.12 59.02,31.31 APA104-48.3 | C-L-48.2 65.55,28.49 65.15,28.09 60.13,28.09 APA104-48.3 | APA104-48.3 59.02,28.44 57.46,26.88 57.46,24.62 59.02,23.06 APA104-47.3 | C-L-47.2 64.94,19.99 64.82,20.11 60.11,20.11 APA104-47.3 | 79.4,17.98 78.46,17.98 APA104-53.3 70.64,13.84 C-L-53.2 70.64,18.85 C-L-52.2 | 67.17,4.6 67.17,8.59 63.9,11.86 62.36,11.86 61.02,13.2 APA104-46.3 | 67.17,4.6 POWER-IN.2 | C-L-46.2 53.55,15.69 53,15.69 | 53,15.69 APA104-44.3 | APA104-44.3 51.12,15.69 49.51,17.3 46.34,17.3 C-L-44.2 | APA104-44.3 54.64,17.35 54.64,21.6 | 54.64,21.6 54.64,21.85 | 54.64,21.85 APA104-43.3 54.89,22.32 54.89,23.08 56.2,24.39 56.2,27.12 54.48,28.84 APA104-42.3 52.98,29.35 51.42,30.91 51.42,33.17 52.14,33.89 C-L-42.2 52.14,35.46 50.36,37.24 C-L-41.2 | APA104-47.3 58.62,21.6 54.64,21.6
  Top 0.254: C-L-40.2 42.83,32.57 42.83,35.38 41.02,37.19 APA104-41.3 35.86,32.04 APA104-40.3 33.44,32.04 32,30.6 32,25.61 APA104-39.3 | C-L-30.2 25.39,30.77 APA104-30.3 | 31.67,25.27 30.89,25.27 APA104-30.3 | APA104-30.3 24.3,29 22.94,27.64 21.28,27.64 19.8,29.12 19.8,33.15 19.7,33.25 APA104-31.3 17.34,34 16.23,32.89 13.29,32.89 APA104-32.3 14.1,31.5 17.5,28.1 17.5,20.6 14.75,17.85 v14,17.85 | APA104-34.3 10.33,16.65 12.06,16.65 12.81,17.4 | 12.81,17.4 17.01,13.2 APA104-36.3 22.86,18.38 APA104-37.3 24.07,18.49 25,18.49 | 25,18.49 29.5,18.49 C-L-37.2 | C-L-39.2 35,23.99 | 35,23.99 33.62,23.99 APA104-39.3 | APA104-45.3 46.94,8.88 61.52,8.88 61.8,8.6 63.17,8.6 67.17,4.6 | APA104-24.3 77,60.1 v78.75,58.35 82.86,58.35 C-L-24.2 | v53.25,13.35 53.25,15.44 53,15.69 | APA104-35.3 12.85,10 11.49,8.64 8.19,8.64 6.96,9.87 6.96,11 7,11.03 C-L-35.2 7.39,11.6 v11.25,11.6 | 12.81,17.4 13.26,17.85 v14,17.85 | C-L-45.2 v43.5,22.1 | APA104-8.3 30,57.34 v30,58.6 | APA104-7.3 21.79,46.7 23.15,45.34 26.64,45.34 C-L-7.2 | APA104-19.3 66.98,55.62 v67,55.6 | 5,51.12 3.62,52.5 3.62,61.11 C-L-4.2 | v31.5,11.35 32.19,12.04 C81.1 36.41,12.04 C82.1 | v7.25,40.85 7.25,41.35 5,43.6 5,51.12 | v7.25,40.85 10.25,37.85 C-L-31.2 | APA104-59.3 97.66,21.82 97.66,18.49 99.25,16.9 99.25,11.85 97.3,9.9 | C83.2 19.53,3.61 RESET.P$1 | C-L-34.2 v14,17.85 | 14,58.6 13.42,58.6 APA104-4.3 11.96,57 14.38,54.58 14.38,52.07 APA104-5.3 12.72,49.6 17,49.6 19.68,46.92 APA104-7.3 | 14,58.6 17,58.6 17.89,59.49 C-L-3.2 18.28,60.71 C-L-2.2 | APA104-2.3 20.85,65 v19.25,66.6 | IC1.4 29.44,3.1 v28.5,3.1 | APA104-59.3 95.03,22.07 v94.75,22.35
  Top 0.254: C-L-36.2 25,13.49 25,18.49 | C-L-33.2 11.53,26.21 APA104-33.3 8.22,26.1 v7.5,26.1 7.5,27.6 5,30.1 5,31.96 C-L-32.2 | C-L-17.2 61,52.21 61,51.6 | 61,51.6 64,51.6 65.42,50.18 APA104-20.3 | 61,51.6 60.25,50.85 60.25,49.6 59.68,49.03 58.18,49.03 | APA104-3.3 14,63.4 14,58.6 | C-L-14.2 45.5,44.46 45.5,41.99 C-L-15.2 v43,41.6 43.75,42.35 C-L-10.2 | C-L-11.2 31.89,60.49 v30,58.6 | APA104-38.3 32.96,18.89 30,21.85 30,23.6 31.67,25.27 | 31.67,25.27 APA104-39.3 | 35,23.99 35.08,23.91 35.08,20.71 38.69,20.71 39.6,19.8 39.67,19.8 41,18.47 C-L-38.2 | C-L9.2 29.61,40.35 25.5,40.35 25.25,40.1 8,40.1 v7.25,40.85 | APA104-13.3 47.41,64.44 C-L-13.2 55.16,64.44 55.34,64.27 | C-L-43.2 48.14,23.6 52.89,23.6 54.64,21.85 | C-L-55.2 84.34,20.62 APA104-55.3 | 97.3,9.9 97.2,9.9 | C-L-60.2 95.75,15.46 95.75,14.85 95.25,14.35 95.25,11.85 95.35,11.85 97.3,9.9 | C-L-25.2 86.5,56.35 v85,54.85 85.14,54.99 C-L-28.2
  Bottom 0.254: v85,54.85 82.25,54.85 v78.75,58.35 76,55.6 v67,55.6 56.25,55.6 v53.75,53.1 | v53.25,13.35 58.22,13.35 POWER-IN.2 85.12,22.35 v94.75,22.35 | 31,13.1 23.68,13.1 RESET.P$1 16.57,6.28 v11.25,11.6 11.25,15.1 v14,17.85 7.5,24.35 v7.5,26.1 | v53.25,13.35 52.25,13.35 v43.5,22.1 43.5,41.1 v43,41.6 43,42.35 v53.75,53.1 | v53.75,53.1 45.75,53.1 v38.5,60.35 31.75,60.35 v30,58.6 | 31,13.1 31.5,12.6 v31.5,11.35 28.5,8.35 v28.5,3.1 | v7.25,40.85 25,58.6 v30,58.6 | v19.25,66.6 26,66.6 v28.25,68.85 30,67.1 v30,58.6 | 31,13.1 53,13.1 v53.25,13.35 | J1.8 48,10.04 48,10.6 49,11.6 52,11.6 53.25,12.85 v53.25,13.35
GPIO_APA104_DATA
  Top 0.254: APA104-1.4 29.64,70.46 29.25,70.85 7.53,70.85 1.24,64.56 1.24,11.63 7.28,5.59 14.01,5.59 18,1.6 25,1.6 28.68,5.27 IC1.3 31.32,5.27 32,4.6 32,3.85 34.75,1.1 46.76,1.1 49.86,4.2 J1.5
GPIO_APA104_DATA1
  Top 0.254: APA104-40.2 40.78,34 APA104-41.4
N$1
  Top 0.254: APA104-2.2 15.1,66.7 APA104-3.4
N$2
  Top 0.254: APA104-3.2 9.1,62.92 APA104-4.4
N$3
  Top 0.254: APA104-4.2 10.82,53.2 APA104-5.4
N$4
  Top 0.254: APA104-5.2 9.46,48.06 12.85,48.06 14.21,46.7 APA104-6.4
N$5
  Top 0.254: APA104-6.2 11.1,43.5 12.5,42.1 18.28,42.1 APA104-7.4
N$6
  Top 0.254: APA104-7.2 25.36,47.58 APA104-8.4
N$7
  Top 0.254: APA104-8.2 33.75,49.11 33.75,44.85 35.21,43.39 APA104-9.4
N$8
  Top 0.254: APA104-9.2 37.39,50.18 APA104-10.4
N$9
  Top 0.254: APA104-10.2 37.11,57.25 APA104-11.4
N$10
  Top 0.254: APA104-11.2 37.61,63.82 APA104-12.4
N$11
  Top 0.254: APA104-12.2 42.79,65.21 APA104-13.4
N$12
  Top 0.254: APA104-13.2 45.6,56.47 APA104-14.4
N$13
  Top 0.254: APA104-14.2 53.48,47.62 APA104-15.4
N$14
  Top 0.254: APA104-15.2 50.52,45.81 54.56,45.81 55.6,46.85 APA104-16.4
N$15
  Top 0.254: APA104-16.2 56.25,55.36 APA104-17.4
N$16
  Top 0.254: APA104-17.2 57.67,63.76 APA104-18.4
N$17
  Top 0.254: APA104-18.2 66.98,65.7 65.67,64.39 65.67,62.88 66.98,61.57 APA104-19.4
N$18
  Top 0.254: APA104-19.2 63.11,57.25 APA104-20.4
N$19
  Top 0.254: APA104-21.2 66.98,46.8 65.17,44.99 65.17,42.98 65.65,42.5 69.42,42.5 70.21,43.3 75.77,43.3 APA104-22.4
N$20
  Top 0.254: APA104-22.2 77.02,50.55 APA104-23.4
N$21
  Top 0.254: APA104-23.2 77.67,56.9 APA104-24.4
N$22
  Top 0.254: APA104-24.2 79.32,60.1 APA104-25.4
N$23
  Top 0.254: APA104-25.2 84.34,63.08 APA104-26.4
N$24
  Top 0.254: APA104-26.2 89.14,65.54 87.58,63.98 87.58,60.45 89.19,58.84 92.1,58.84 93.21,59.95 APA104-27.4
N$25
  Top 0.254: APA104-27.2 94.32,52.95 APA104-28.4
N$26
  Top 0.254: APA104-28.2 90.52,48.83 APA104-29.4
N$27
  Top 0.254: APA104-29.2 84.26,44.17 84.26,39.89 83.71,39.34 31.74,39.34 27.16,34.76 APA104-30.4
N$28
  Top 0.254: APA104-31.4 21.61,35.29 21.61,33.39 21.05,32.83 21.05,31.57 22.36,30.26 APA104-30.2
N$29
  Top 0.254: APA104-20.2 62.18,49.75 63.74,48.19 63.74,45.68 62.18,44.12 APA104-21.4
N$30
  Top 0.254: APA104-42.4 54.35,33.41 54.35,35.76 51.66,38.45 46.84,38.45 45.82,37.43 APA104-41.2
N$31
  Top 0.254: APA104-1.2 24.84,61.76 23,63.6 23,66.8 APA104-2.4
N$32
  Top 0.254: APA104-31.2 14.2,34.7 APA104-32.4
N$33
  Top 0.254: APA104-32.2 7.1,30.42 APA104-33.4
N$34
  Top 0.254: APA104-33.2 5.02,24.16 8.98,20.2 APA104-34.4
N$35
  Top 0.254: APA104-34.2 5.29,17 6.9,15.39 11.63,15.39 APA104-35.4
N$36
  Top 0.254: APA104-35.2 11.63,10 12.74,11.11 15.15,11.11 16.26,10 APA104-36.4
N$37
  Top 0.254: APA104-36.2 22.86,13.58 APA104-37.4
N$38
  Top 0.254: APA104-38.4 32.42,15.69 31.63,16.48 31.63,18.98 30.16,20.45 29.59,20.45 28.41,20.45 APA104-37.2
N$39
  Top 0.254: APA104-38.2 35.52,18.89 35.13,19.28 35.13,19.54 34.87,19.8 34.61,19.8 APA104-39.4
N$40
  Top 0.254: APA104-39.2 34.02,28.39 APA104-40.4
N$41
  Top 0.254: APA104-51.4 77.13,31.6 77.13,35.23 76.16,36.2 72.98,36.2 APA104-50.2
N$42
  Top 0.254: APA104-42.2 49.82,28.84 53.39,25.27 APA104-43.4
N$43
  Top 0.254: APA104-43.2 52.98,18.93 APA104-44.4
N$44
  Top 0.254: APA104-44.2 45.82,13.33 APA104-45.4
N$45
  Top 0.254: APA104-45.2 43.13,10 44.24,11.11 47.15,11.11 48.26,10 APA104-46.4
N$46
  Top 0.254: APA104-46.2 APA104-47.4
N$47
  Top 0.254: APA104-47.2 APA104-48.4
N$48
  Top 0.254: APA104-49.4 60.15,32.87 60.15,31.19 62.14,29.2 APA104-48.2
N$49
  Top 0.254: APA104-49.2 67.68,33.34 APA104-50.4
N$51
  Top 0.254: APA104-51.2 APA104-52.4
N$52
  Top 0.254: APA104-52.2 72.48,16.01 APA104-53.4
N$53
  Top 0.254: APA104-53.2 69.68,10 APA104-54.4
N$54
  Top 0.254: APA104-54.2 84.34,17.84 APA104-55.4
N$55
  Top 0.254: APA104-56.4 84.5,24.09 87.39,21.2 APA104-55.2
N$56
  Top 0.254: APA104-56.2 88.05,29.2 88.03,29.22 86.87,29.22 85.02,31.07 85.02,33.5 APA104-57.4
N$57
  Top 0.254: APA104-57.2 92.18,34.34 APA104-58.4
N$58
  Top 0.254: APA104-58.2 97.38,37.6 99,37.6 99,26.6 97.67,25.27 APA104-59.4
N$59
  Top 0.254: APA104-59.2 97.3,17.38 APA104-60.4
PB0-MOSI
  Top 0.254: IC1.5 37.6,4.01 39.44,5.85 50.33,5.85 51.9,4.28 J1.4
PB1-MISO
  Top 0.254: IC1.6 37.65,5.27 38.98,6.61 53.61,6.61 54.94,5.28 J1.3
PB2-SCK
  Top 0.254: IC1.7 36.52,6.55 37.27,7.3 54.47,7.3 J1.2
PB3
  Top 0.254: J1.6 47.32,4.2 45.14,2.02 34.83,2.02 33.12,3.73 | 33,3.85 33.12,3.73 | 33.12,3.73 33,3.85 | 33,3.85 33,5.6 32.05,6.55 IC1.2
RESET
  Top 0.254: J1.7 43.21,2.71 35.19,2.71 34,3.9 34,6.1 32.28,7.82 IC1.1 27.81,7.82 27.47,7.47 27.47,7.09 25.99,5.61 | 25.99,5.61 R1.2 | C83.1 23.85,5.82 RESET.P$2 25.32,6.28 25.99,5.61
VDD  (via drill 0.8)
  Top 0.254: APA104-4.1 6.86,60.36 6.89,60.38 C-L-4.1 | C-L-17.1 60.3,61.17 APA104-17.1 | C-L-17.1 60.3,60.9 62,62.6 63,62.6 63,62.64 64.24,63.88 64.24,67.84 65,68.6 69,68.6 70,67.6 C-L-18.1 | APA104-19.1 63.89,58.74 68.5,58.74 | 68.5,44.96 C-L-21.1 77.75,44.96 78.14,44.57 C-L-22.1 80.34,43.55 APA104-22.1 82,44.73 82,49.96 C-L-23.1 | 68.5,44.96 68.33,44.96 APA104-21.1 | C-L-23.1 81.23,50.96 APA104-23.1 | C-L-24.1 83,56.71 83,54.86 84.38,53.48 84.38,52 83.41,51.02 83.06,51.02 C-L-23.1 | C-L-24.1 83.19,56.9 APA104-24.1 | C-L-28.1 87.76,52.95 APA104-28.1 | C-L-28.1 86.11,51.82 C-L-29.1 | C-L-29.1 84.34,48.08 APA104-29.1 | C-L-5.1 5,60.21 6.01,61.22 5.83,61.22 5.83,61.29 6.89,62.35 C-L-4.1 | C-L-4.1 6.89,64.49 APA104-3.1 9.9,66.7 11.75,64.85 14.75,64.85 16.11,63.49 16.11,63.1 | C-L-29.1 85.86,49.6 84,49.6 83,48.6 83,42.1 81,40.1 30.75,40.1 28.75,38.1 25,38.1 23.61,36.71 C-L-30.1 | C-L-30.1 23.61,33.45 APA104-30.1 | C-L-31.1 13.39,39.1 20.11,39.1 23.61,35.6 C-L-30.1 | C-L-31.1 14.25,37.85 APA104-31.1 | C-L-37.1 29.29,16.5 APA104-37.1 | C-L-38.1 39.59,16.46 APA104-38.1 | C-L-39.1 39.36,22.07 APA104-39.1 | C-L-40.1 40.88,28.84 APA104-40.1 | 46,35.46 44.86,35.46 44,34.6 44,31.37 41.91,29.27 41.56,29.27 41.25,28.96 C-L-40.1 | 46,35.46 C-L-41.1 49.25,35.46 C-L-42.1 | C-L-42.1 48.18,32.17 APA104-42.1 | C-L-42.1 50.36,30.7 47.35,30.7 46.25,29.6 46.25,26.49 C-L-43.1 | C-L-44.1 46,24.43 45.94,24.43 46.5,24.99 C-L-43.1 | C-L-44.1 48.03,18.74 APA104-44.1 | C-L-45.1 41.02,13.98 APA104-45.1 | C-L-45.1 44.01,15.95 44.01,12.82 44.87,11.96 55.5,11.96 C-L-46.1 55.9,11.86 56.25,11.86 | APA104-46.1 61.71,10 59.85,11.86 56.25,11.86
  Top 0.254: C-L-48.1 66,23.36 67.63,21.73 67.63,19.34 66.5,18.21 C-L-47.1 64.03,18.21 APA104-47.1 61.35,18 60,19.35 57.43,19.35 57.43,13.04 56.25,11.86 | C-L-50.1 74.54,32.5 APA104-50.1 | C-L-51.1 72.5,29.71 74.75,31.96 C-L-50.1 | C-L-51.1 74.26,28.99 APA104-51.1 | C-L-53.1 68.86,16.38 APA104-53.1 | C-L-56.1 89.3,23.69 APA104-56.1 | C-L-56.1 89.39,26.6 91.11,28.32 91.11,30.13 89.64,31.6 C-L-57.1 | C-L-57.1 88.89,33.57 APA104-57.1 | C-L-57.1 94.61,31.6 C-L-58.1 | C-L-58.1 95.11,32.13 APA104-58.1 | C-L-58.1 93.11,29.1 C-L-59.1 | C-L-59.1 93.11,25.77 APA104-59.1 | APA104-60.1 92.5,13.99 C-L-60.1 94.11,18.63 91.3,21.44 91.3,26.54 92.36,27.6 C-L-59.1 | POWER-IN.1 61.43,7.6 v60,7.6 | J1.1 60,4.3 v60,7.6 | C-L-5.1 5.34,53.49 6.21,52.62 6.21,48.37 8.09,46.49 | C-L-43.1 49.56,24.99 APA104-43.1 | APA104-5.1 7.6,53.2 7.89,53.49 C-L-5.1 | C-L-31.1 12.33,37.66 12.33,36.94 11.6,36.22 5.75,36.22 4.5,34.97 C-L-32.1 | C-L-14.1 45.75,50.35 46.69,51.29 46.69,51.54 47,51.85 47,55.85 48.8,57.65 48.8,61.59 | C-L-14.1 47.24,47.98 APA104-14.1 | 47.37,45.93 47.06,45.93 46.5,46.49 C-L-14.1 | v60,7.6 59.94,7.54 59.42,8.05 39,8.05 38.5,8.55 v38.5,8.6 | IC1.8 35.77,8.23 C81.2 36.41,10.26 C82.2 36.76,10.34 v38.5,8.6 | v38.5,8.6 38.5,13.6 31.75,13.6 v27.25,9.1 | v27.25,9.1 25.97,7.82 R1.1 | C-L-7.1 24.89,41.1 9.49,41.1 6.87,43.72 6.87,45.47 7.89,46.49 8.09,46.49 | C-L-7.1 24.77,43.21 APA104-7.1 | APA104-13.1 48.8,61.59 | 48.8,61.59 C-L-13.1 48.47,62.77 46.82,61.11 45.41,61.11 44.04,62.48 44.04,66.65 42.23,68.45 40.15,68.45 39,69.6 38,69.6 | APA104-6.1 8.71,46.7 C-L-6.1 8.09,46.49 | 38,69.6 31,69.6 31,66.6 31.89,65.71 C-L-12.1 33.5,62.6 34.5,61.6 34.5,58.6
  Top 0.254: APA104-12.1 38,66.8 38,69.6 | C-L-53.1 69,17.46 69,13.6 66.98,13.6 66.48,13.11 66.48,10.87 69.46,7.89 84.96,7.89 85.25,7.6 C-L-54.1 88.98,8.73 APA104-54.1 90.75,11.77 90.75,15.21 C-L-55.1 91,15.74 91,17.6 90.6,18 APA104-55.1 90.5,19.36 90.5,22.53 89.89,23.14 89.85,23.14 C-L-56.1 | 16,24.6 16,27.35 15.5,27.85 14.14,27.85 C-L-33.1 13.11,27.99 10,31.1 10,33.6 5.39,33.6 4.75,34.24 C-L-32.1 | 16,24.6 12.25,24.6 10.5,22.85 8.75,22.85 5.02,26.58 APA104-33.1 | 16,24.6 13.68,22.28 13.68,21.92 C-L-34.1 12.64,22.24 12,21.6 12,18.6 7,18.6 5.36,20.24 5.14,20.24 APA104-34.1 4,19.02 4,15.6 6.61,12.99 C-L-35.1 8.81,12.99 APA104-35.1 11.46,13.2 12.53,12.13 12.53,12.1 16.25,12.1 16.75,11.6 25.11,11.6 C-L-36.1 | C-L-32.1 4.96,34.7 APA104-32.1 | C-L-2.1 21.61,62.49 24.5,59.6 26,59.6 26,63.54 APA104-1.1 24.86,64.72 C-L-1.2 24.86,68.1 23.36,69.6 8.75,69.6 2.75,63.6 2.75,12.09 7.74,7.1 15,7.1 16,8.1 19.81,8.1 20.06,8.35 26.5,8.35 v27.25,9.1 | APA104-2.1 16.8,66.94 21,62.74 C-L-2.1 | C-L-3.1 16.11,63.1 | C-L-2.1 20.39,63.1 16.11,63.1 | v27.25,9.1 27.25,12.85 29.75,15.35 C-L-37.1 | v27.25,9.1 25.25,11.1 C-L-36.1 | C-L-36.1 23.79,10 APA104-36.1 | C-L-18.1 69.73,63.76 APA104-18.1 | C-L-18.1 69.39,63.49 68.5,62.6 68.5,59.85 69.61,58.74 C-L-19.1 68.5,58.74 | 68.5,58.74 68.5,54.85 69.86,53.49 C-L-20.1 69.39,53.49 68.5,52.6 68.5,51.6 | C-L-17.1 62.11,53.38 APA104-20.1 64.22,53.38 66,51.6 68.5,51.6 | 68.5,51.6 68.5,44.96 | C-L-17.1 58.16,55.18 APA104-16.1 57.24,52.24 C-L-16.1 | 47.37,45.93 48.62,47.17 APA104-15.1 | C-L-27.1 97,58.6 96.42,58.02 89.6,58.02 89,57.42 89,54.1 88.11,53.21 C-L-28.1
  Top 0.254: C-L-26.1 92.11,65.99 90.5,67.6 87,67.6 86.5,67.1 C-L-25.1 86.32,59.17 | APA104-26.1 92.11,65.57 C-L-26.1 | C-L-15.1 47.14,41.85 47.14,45.69 47.37,45.93 | C-L-37.1 29.62,16.83 29.62,16.27 31.29,14.6 39.64,14.6 41,15.96 C-L-38.1 | APA104-11.1 40.35,57.25 39,58.6 34.5,58.6 | 34.5,58.6 32.86,58.6 C-L-11.1 32.75,56.85 35,54.6 38,54.6 39,53.6 39,51.6 39.56,51.6 APA104-10.1 | C-L-10.1 42.04,51.24 APA104-10.1 | APA104-10.1 40.98,49.87 42.25,48.6 42.25,44.66 APA104-9.1 39.69,42.1 C-L9.1 33.14,44.6 | APA104-27.1 91.52,60.95 91.52,61.12 93,62.6 96.89,62.6 C-L-27.1 | APA104-25.1 81.2,63.4 84,60.6 84.89,60.6 86.32,59.17 | APA104-41.1 45.82,35.28 46,35.46 | C-L-51.1 71.25,28.99 70.37,28.11 70.37,25.22 72,23.59 72,22.35 72.25,22.1 | APA104-52.1 74.27,21.33 73.5,22.1 72.25,22.1 | 72.25,22.1 72.11,22.1 C-L-52.1 69.39,21.99 69,21.6 69,17.74 C-L-53.1 | C-L-24.1 84.11,56.96 86.32,59.17 | C-L-48.1 67.34,26.71 67.88,27.25 67.88,29.23 67.16,29.95 65.53,29.95 C-L-49.1 63.89,33.93 APA104-49.1 66.93,30.89 68.46,30.89 71.09,33.52 73.77,33.52 73.82,33.47 73.99,33.47 C-L-50.1 | APA104-48.1 64.07,26.25 65.29,26.25 65.75,26.71 C-L-48.1 | APA104-8.1 30,49.34 C-L-8.1 30.39,46.6 32,46.6 33.14,45.46 33.14,44.6 | C-L-45.1 43.72,16.46 44.82,17.56 44.82,17.72 45.07,17.98 45.24,17.98 C-L-44.1 | C-L-38.1 41.76,17.22 41.93,17.22 42.18,17.48 42.18,19.53 C-L-39.1 | 33.14,44.6 31.82,43.28 30.6,43.28 30.53,43.21 C-L-7.1 | C-L-26.1 92,65.74 92,64.6 93,63.6 95.5,63.6 96.39,62.71 C-L-27.1 | C-L-39.1 40.36,22.21 41,22.85 C-L-40.1

### Text on the board
Top: cmdc0de, 9-2018-03 | + -